# EAGLE design PortableWiFiRepeater (EAGLE 9.6.2)
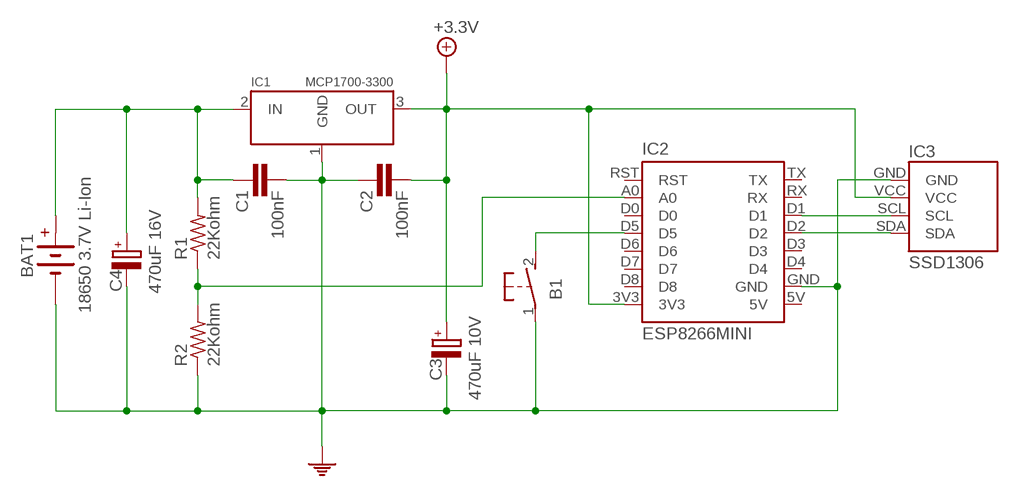
[diagram p0: schematic, sheet 1]

## Parts
B1  BUTTONSIL2  [SIL2]
BAT1  18650 3.7V Li-Ion  BATTERYJST2  [JST2]
C1  100nF  CAPACITOR5MM  [CAPACITOR-5MM]
C2  100nF  CAPACITOR5MM  [CAPACITOR-5MM]
C3  470uF 10V  CAPACITOR_EL5MM  [CAPACITOR-5MM]
C4  470uF 16V  CAPACITOR_EL5MM  [CAPACITOR-5MM]
IC1  MCP1700-3300  MCP1700  [TO92]
IC2  ESP8266MINI  [ESP8266MINI]
IC3  SSD1306  [SSD1306]
R1  22Kohm  RESISTOR0.25W  [RESISTOR-0.25W]
R2  22Kohm  RESISTOR0.25W  [RESISTOR-0.25W]

## Nets
+3.3V: C2.2 C3.1 IC1.3(OUT) IC2.3V3 IC3.VCC
GND: B1.1(P) BAT1.2(-) C1.2 C2.1 C3.2 C4.2 IC1.1(GND) IC2.GND IC3.GND R2.1
N$1: BAT1.1(+) C1.1 C4.1 IC1.2(IN) R1.2
N$2: B1.2(S) IC2.D5
N$3: IC2.D1 IC3.SCL
N$4: IC2.D2 IC3.SDA
N$5: IC2.A0 R1.1 R2.2
Unconnected: IC2.D0 IC2.D3 IC2.D4 IC2.D6 IC2.D7 IC2.D8 IC2.RST IC2.RX IC2.TX

## Power pins joined to a net without a drawn wire
5V: IC2.5V

## Library data of the parts
B1 = wizzent:BUTTON: Button
BAT1 = wizzent:BATTERY: Battery
C1 C2 = wizzent:CAPACITOR: Capacitor
C3 C4 = wizzent:CAPACITOR_EL: Electrolytic Capacitor
IC1 = wizzent:MCP1700: MCP1700
IC2 = wizzent:ESP8266MINI: ESP8266 Mini
IC3 = wizzent:SSD1306: SSD1306
R1 R2 = wizzent:RESISTOR: Resistor

## Board
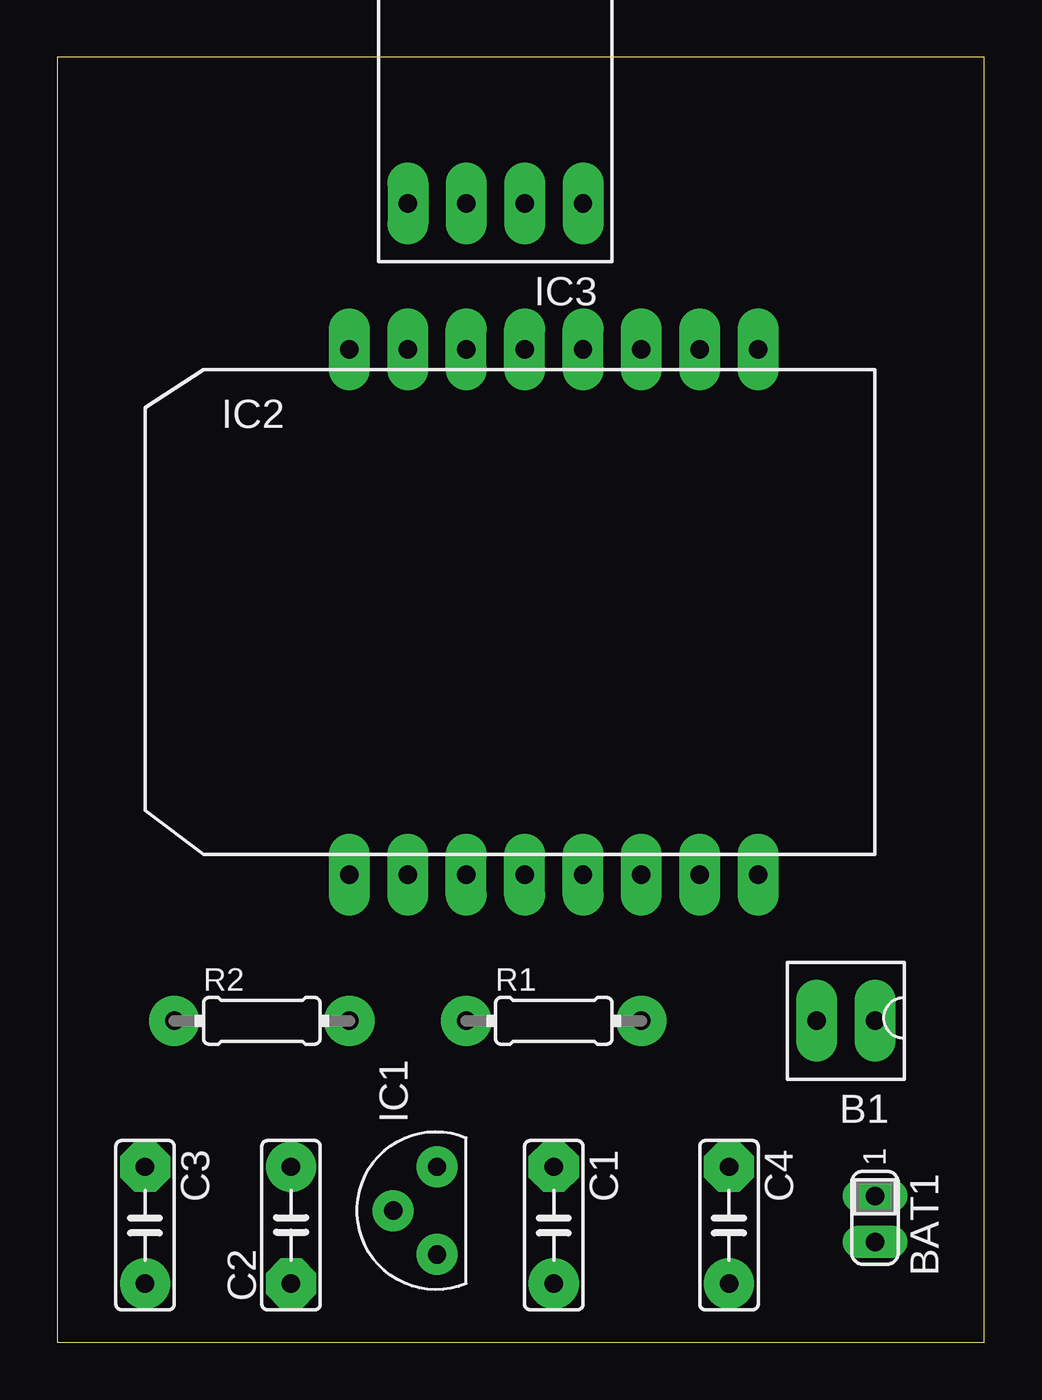
[diagram p1: board, top side]
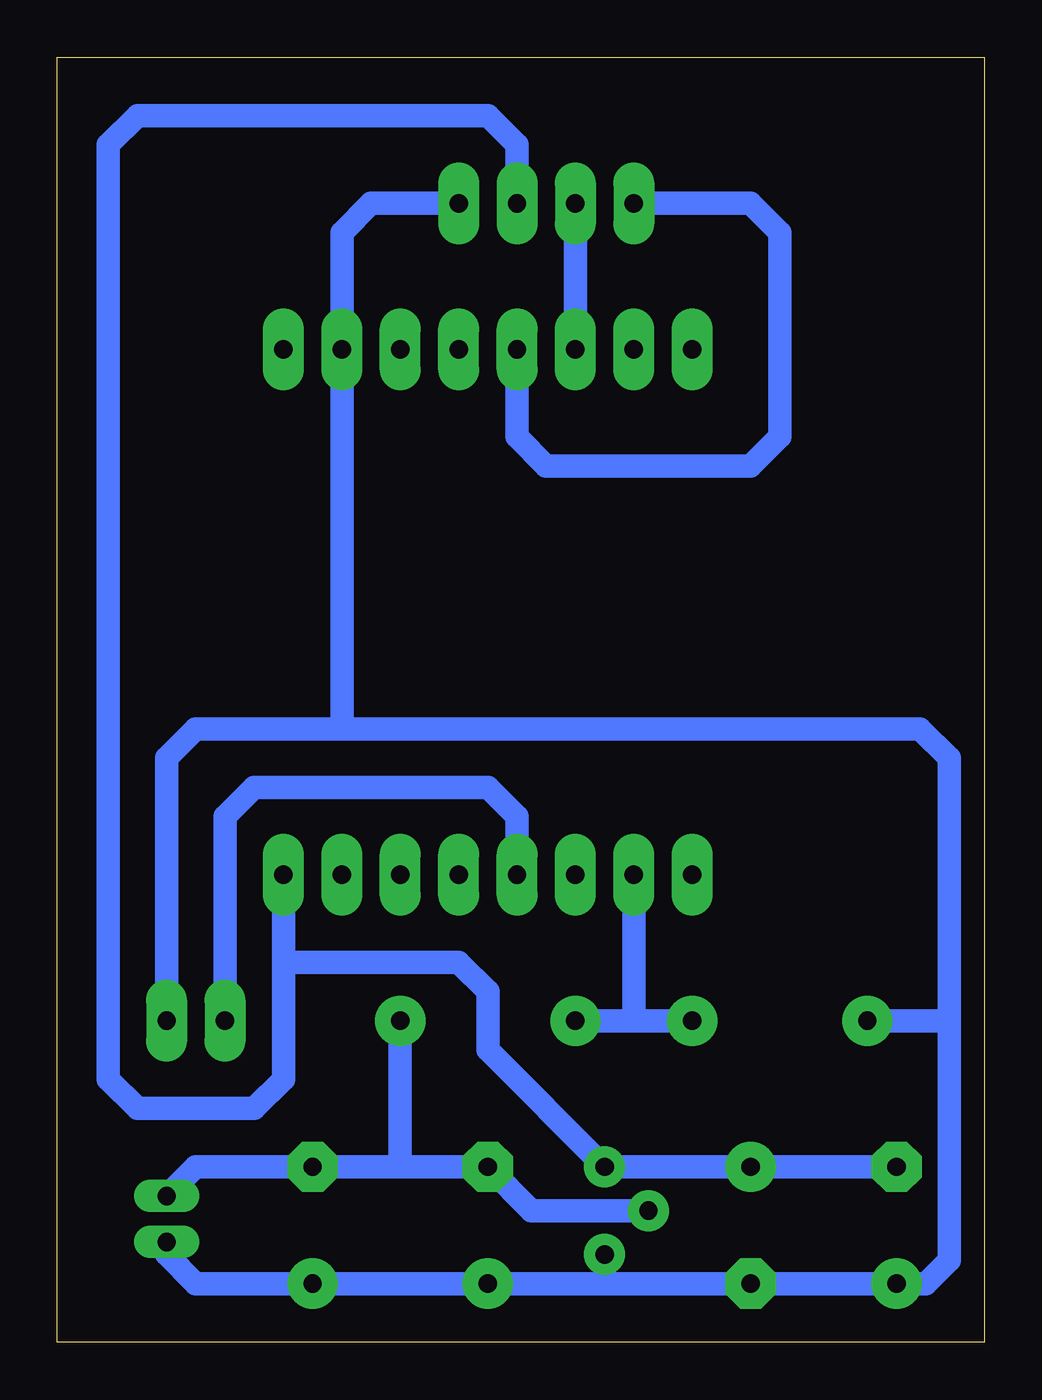
[diagram p2: board, bottom side, seen from below]

Size 40.31 x 55.87 mm. Coordinates in mm from the lower left corner, seen from the top.
Outline: 0,0 40.31,0 40.31,55.87 0,55.87 0,0
Copper layers (1*16): Top 0.035mm / dielectric 1.5mm / Bottom 0.035mm
Design rules "default": minimum track width 6mil, minimum drill 0.35mm, track to track 6mil, track to pad 6mil, pad to pad 6mil, via to via 6mil, smd to smd 6mil, copper to edge 40mil, drill to drill 6mil, minimum pad ring 10mil, minimum via ring 8mil, stop-mask expansion 4mil, vias tented up to drill 0mil, thermal gap 10mil

### Footprints (pad centres in the part's own frame; a part is rotated, then mirrored left to right if it is on the bottom)
SIL2 = drill 0.8 pad 1.778 long: 1 0,0; 2 2.54,0
JST2 = drill 0.8 pad 1.422 long: 1 0,0; 2 2,0
CAPACITOR-5MM = drill 0.8 pad 2.184 octagon: 1 -2.54,0 | drill 0.8 pad 2.184: 2 2.54,0
TO92 = drill 0.8 pad 1.778: 1 -1.27,0; 2 0.635,1.905; 3 2.54,0
ESP8266MINI = drill 0.8 pad 1.778 long: 3V3 17.78,0; 5V 17.78,22.86; A0 2.54,0; D0 5.08,0; D1 5.08,22.86; D2 7.62,22.86; D3 10.16,22.86; D4 12.7,22.86; D5 7.62,0; D6 10.16,0; D7 12.7,0; D8 15.24,0; GND 15.24,22.86; RST 0,0; RX 2.54,22.86; TX 0,22.86
SSD1306 = drill 0.8 pad 1.778 long: GND 0,0; SCL 5.08,0; SDA 7.62,0; VCC 2.54,0
RESISTOR-0.25W = drill 0.8 pad 2.184: 1 -3.81,0; 2 3.81,0

### Placement (x,y rotation side)
B1  35.56,13.97 180 top
BAT1  35.56,6.35 270 top
C1  21.59,5.08 270 top
C2  10.16,5.08 90 top
C3  3.81,5.08 270 top
C4  29.21,5.08 270 top
IC1  16.51,5.08 90 top
IC2  12.7,20.32 0 top
IC3  22.86,49.53 180 top
R1  21.59,13.97 0 top
R2  8.89,13.97 0 top

### Tracks (layer width: path | path; a pad name or v marks a point on that pad's centre or on a via)
+3.3V
  Bottom 1.016: C3.1 C2.2 IC1.3 21.59,12.7 21.59,15.24 22.86,16.51 30.48,16.51 | 30.48,16.51 IC2.3V3 | 30.48,16.51 30.48,11.43 31.75,10.16 36.83,10.16 38.1,11.43 38.1,52.07 36.83,53.34 21.59,53.34 20.32,52.07 IC3.VCC
GND
  Bottom 1.016: BAT1.2 35.56,3.81 34.29,2.54 C4.2 C1.2 16.51,2.54 | IC1.1 16.51,2.54 | 16.51,2.54 C2.1 C3.2 2.54,2.54 1.52,3.56 1.52,13.97 | 27.94,26.67 2.79,26.67 1.52,25.4 1.52,13.97 | R2.1 1.52,13.97 | IC3.GND 26.67,49.53 27.94,48.26 IC2.GND 27.94,26.67 | B1.1 35.56,25.4 34.29,26.67 27.94,26.67
N$1
  Bottom 1.016: C4.1 C1.1 19.68,5.71 IC1.2 | BAT1.1 34.29,7.62 C4.1 | C4.1 25.4,7.62 R1.2
N$2
  Bottom 1.016: B1.2 33.02,22.86 31.75,24.13 21.59,24.13 20.32,22.86 IC2.D5
N$3
  Bottom 1.016: IC2.D1 IC3.SCL
N$4
  Bottom 1.016: IC2.D2 20.32,39.37 19.05,38.1 10.16,38.1 8.89,39.37 8.89,48.26 10.16,49.53 IC3.SDA
N$5
  Bottom 1.016: R2.2 15.24,13.97 | 15.24,13.97 R1.1 | IC2.A0 15.24,13.97